# EAGLE design serial_relay (EAGLE 9.0.1)
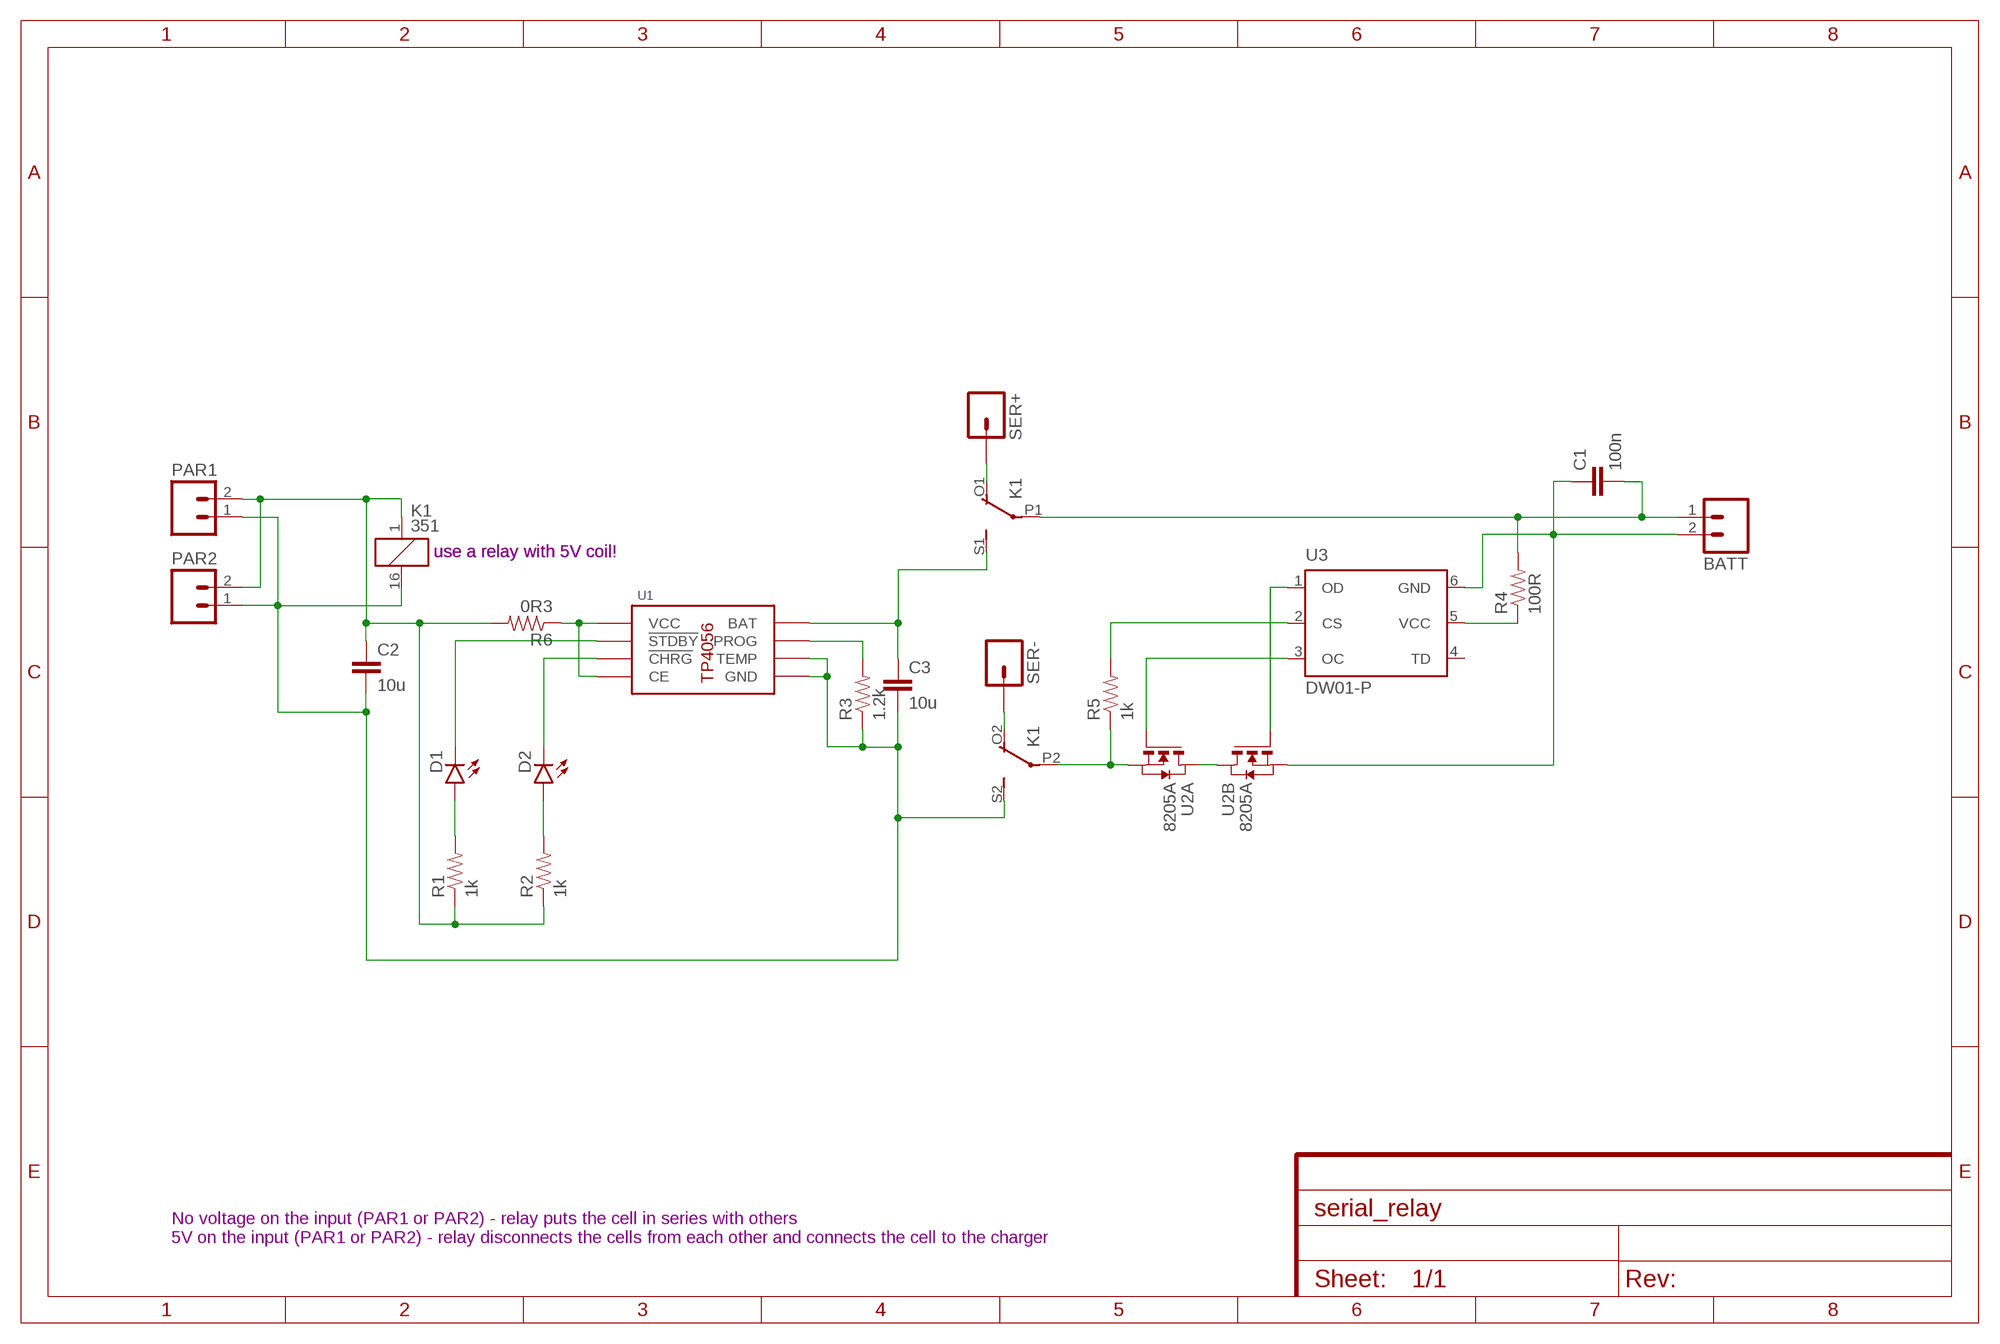
[diagram p0: schematic, sheet 1]

## Parts
BATT  M02PTH3  [1X02_LONGPADS]
C1  100n  CAP1206  [1206]
C2  10u  CAP1206  [1206]
C3  10u  CAP1206  [1206]
D1  LED1206  [LED-1206]
D2  LED1206  [LED-1206]
K1  351  [351]
PAR1  M02PTH3  [1X02_LONGPADS]
PAR2  M02PTH3  [1X02_LONGPADS]
R1  1k  RESISTOR1206  [1206]
R2  1k  RESISTOR1206  [1206]
R3  1.2k  RESISTOR1206  [1206]
R4  100R  RESISTOR1206  [1206]
R5  1k  RESISTOR1206  [1206]
R6  0R3  RESISTOR1206  [1206]
SER+  M01PTH_LONGPAD  [1X01_LONGPAD]
SER-  M01PTH_LONGPAD  [1X01_LONGPAD]
U1  TP4056  [SOP8]
U2  8205A  [TSSOP8]
U3  DW01-P  [SOT23-6L]

## Nets
N$1: K1.P2(3:P) R5.1 U2.2(A:S) U2.3(A:S)
N$2: K1.O1(2:O) SER+.1
N$3: K1.O2(3:O) SER-.1
N$4: D1.A R1.2
N$5: D1.C U1.6(!STDBY)
N$6: R4.1 U3.5(VCC)
N$7: D2.A R2.2
N$8: BATT.2 C1.1 U2.6(B:S) U2.7(B:S) U3.6(GND)
N$9: U2.1(A:D) U2.8(B:D)
N$10: U2.5(B:G) U3.1(OD)
N$11: U2.4(A:G) U3.3(OC)
N$12: D2.C U1.7(!CHRG)
N$13: R5.2 U3.2(CS)
N$14: R3.2 U1.2(PROG)
N$15: R6.1 U1.4(VCC) U1.8(CE)
N$18: C2.1 K1.1 PAR1.2 PAR2.2 R1.1 R2.1 R6.2
N$19: C2.2 C3.2 K1.16 K1.S2(3:S) PAR1.1 PAR2.1 R3.1 U1.1(TEMP) U1.3(GND)
V+: BATT.1 C1.2 K1.P1(2:P) R4.2
V_BATT: C3.1 K1.S1(2:S) U1.5(BAT)
Unconnected: U3.4(TD)

## Notes on the sheet
- use a relay with 5V coil! | use a relay with 5V coil!
- No voltage on the input (PAR1 or PAR2) - relay puts the cell in series with others
  5V on the input (PAR1 or PAR2) - relay disconnects the cells from each other and connects the cell to the charger

## Library data of the parts
BATT PAR1 PAR2 = SparkFun-Connectors:M02: Standard 2-pin 0.1" header. Use with - straight break away headers ( PRT-00116) - right angle break away headers (PRT-00553) - swiss pins (PRT-00743) - machine pins (PRT-00117) - female headers (PRT-00115) Molex polarized connector foot print use with: PRT-08233 with associated crimp pins and housings. 2.54_SCREWTERM for use with PRT-10571. 3.5mm Screw Terminal footprints for PRT-08084 5mm Screw Terminal footprints for use with PRT-08432
C1-C3 = SparkFun-Capacitors:CAP: Capacitor Standard 0603 ceramic capacitor, and 0.1" leaded capacitor.
D1 D2 = SparkFun-LED:LED: LEDs Standard schematic elements and footprints for 5mm, 3mm, 1206, and 0603 sized LEDs. 5mm - Spark Fun Electronics SKU : COM-00529 (and others)
K1 = relay:351: RELAY 2 x switch, Omron; OC_FARNELL: unknown; OC_NEWARK: unknown
R1-R6 = SparkFun-Resistors:RESISTOR: Resistor Basic schematic elements and footprints for 0603, 1206, and PTH resistors.
SER+ SER- = SparkFun-Connectors:M01: Header 1 Standard 1-pin 0.1" header. Use with straight break away headers (SKU : PRT-00116), right angle break away headers (PRT-00553), swiss pins (PRT-00743), machine pins (PRT-00117), and female headers (PRT-00115). SMTSO-256-ET is a "flush mount" nut for a 4-40 screw. The older package used to be too tight, and did not allow it to sit properly thru the drill hit. The latest (0.165DIA) fits nice and snug.
U1 = custom:TP4056
U2 = lipo:8205A: DUAL N-CHANNEL MOSFET The 8205A uses advanced trench technology to provide excellent RDS(ON), low gate charge and operation with gate voltages as low as 2.5V. This device is suitable for use as a Battery protection or in other Switching application.
U3 = lipo:DW01-P: One Cell Lithium-ion/Polymer Battery Protection IC The DW01-P battery protection IC is designed to protect lithium-ion/polymer battery from damage or degrading the lifetime due to overcharge, overdischarge, and/or overcurrent for one-cell lithium-ion/polymer battery powered systems, such as cellular phones. The ultra-small package and less required external components make it ideal to integrate the DW01-P into the limited space of battery pack. The accurate ±50mV overcharging detection voltage ensures safe and full utilization charging. The very low standby current drains little current from the cell while in storage.

## Board
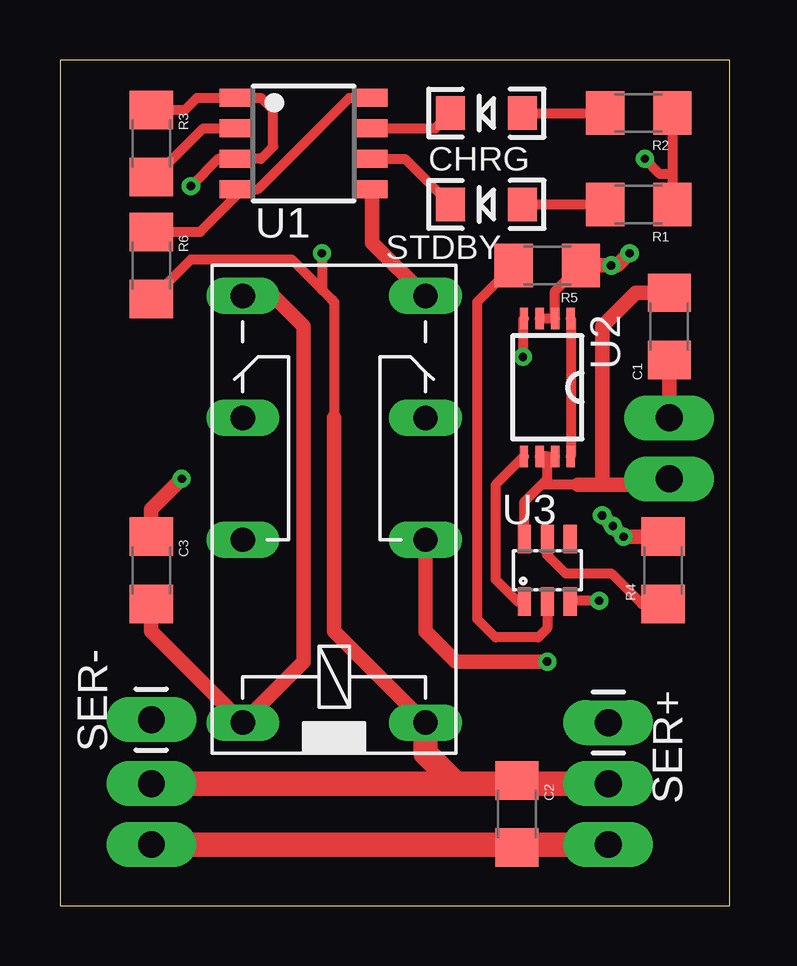
[diagram p1: board, top side]
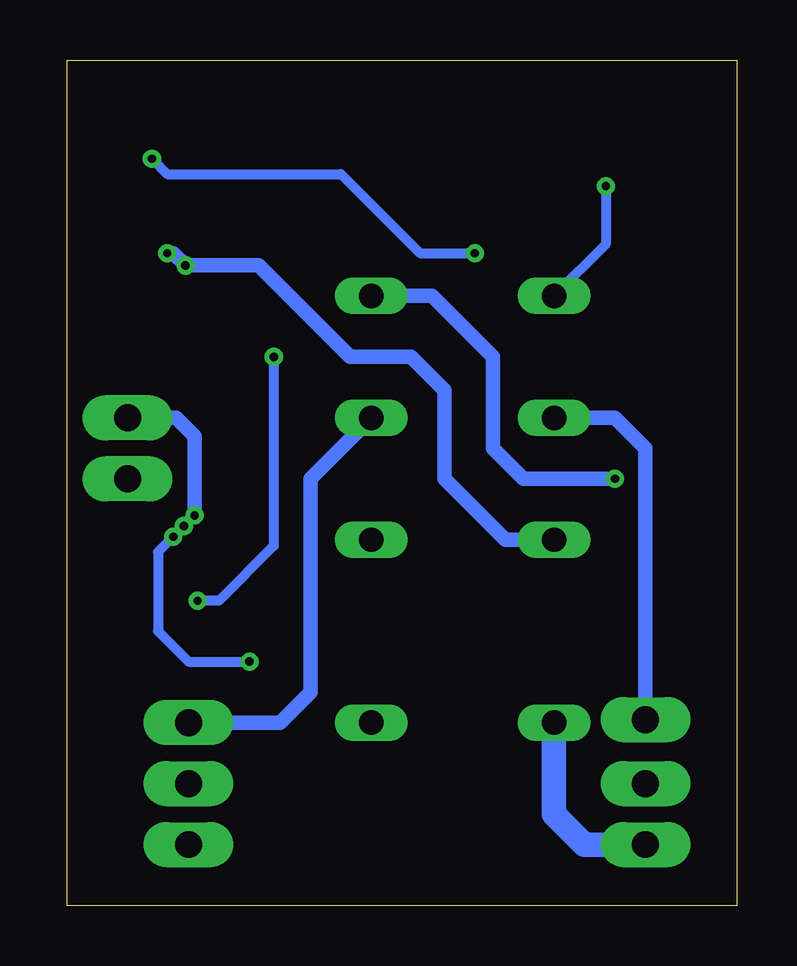
[diagram p2: board, bottom side, seen from below]

Size 27.92 x 35.23 mm. Coordinates in mm from the lower left corner, seen from the top.
Outline: 0,0 27.92,0 27.92,35.23 0,35.23 0,0
Copper layers (1*16): Top 0.035mm / dielectric 1.5mm / Bottom 0.035mm
Design rules "default": minimum track width 6mil, minimum drill 0.35mm, track to track 6mil, track to pad 6mil, pad to pad 6mil, via to via 6mil, smd to smd 6mil, copper to edge 40mil, drill to drill 6mil, minimum pad ring 10mil, minimum via ring 8mil, stop-mask expansion 4mil, vias tented up to drill 0mil, thermal gap 10mil

### Footprints (pad centres in the part's own frame; a part is rotated, then mirrored left to right if it is on the bottom)
1X02_LONGPADS = drill 1.118 pad 1.88 long: 1 0,0; 2 2.54,0
1206 = smd 1.6 x 1.8: 1 -1.4,0; 2 1.4,0
LED-1206 = smd 1.2 x 1.4: A -1.5,0; C 1.5,0
351 = drill 1.016 long: 1 -3.81,-3.81; 16 -3.81,3.81; O1 8.89,-3.81; O2 8.89,3.81; P1 3.81,-3.81; P2 3.81,3.81; S1 13.97,-3.81; S2 13.97,3.81
1X01_LONGPAD = drill 1.118 pad 1.88 long: 1 0,0
SOP8 = smd 0.76 x 1.27: 1 -1.905,-2.86; 2 -0.635,-2.86; 3 0.635,-2.86; 4 1.905,-2.86; 5 1.905,2.86; 6 0.635,2.86; 7 -0.635,2.86; 8 -1.905,2.86
TSSOP8 = smd 0.9 x 0.35: 1 -2.875,0.975; 2 -2.875,0.325; 3 -2.875,-0.325; 4 -2.875,-0.975; 5 2.875,-0.975; 6 2.875,-0.325; 7 2.875,0.325; 8 2.875,0.975
SOT23-6L = smd 0.55 x 1.2: 1 -0.95,-1.3; 2 0,-1.3; 3 0.95,-1.3; 4 0.95,1.3; 5 0,1.3; 6 -0.95,1.3

### Placement (x,y rotation side)
BATT  25.4,20.32 270 top
C1  25.4,24.13 270 top
C2  19.05,3.81 270 top
C3  3.81,13.97 270 top
D1  17.78,29.21 180 top
D2  17.78,33.02 180 top
K1  11.43,11.43 90 top
PAR1  3.81,2.54 90 top
PAR2  22.86,2.54 90 top
R1  24.13,29.21 180 top
R2  24.13,33.02 180 top
R3  3.81,31.75 270 top
R4  25.15,13.97 90 top
R5  20.32,26.67 180 top
R6  3.81,26.67 270 top
SER+  22.86,7.62 270 top
SER-  3.81,7.75 90 top
U1  10.16,31.75 270 top
U2  20.32,21.59 270 top
U3  20.32,13.97 0 top

### Tracks (layer width: path | path; a pad name or v marks a point on that pad's centre or on a via)
N$1  (via drill 0.35)
  Top 0.406: U2.3 U2.2 20.64,25.59 R5.1
  Top 0.61: R5.1 v22.99,26.67 23.24,26.67 v23.75,27.18
  Bottom 0.61: K1.P2 9.65,15.24 12.19,17.78 12.19,21.46 13.59,22.86 16.13,22.86 19.94,26.67 v22.99,26.67 23.5,27.18 v23.75,27.18
N$2
  Bottom 0.61: K1.O1 17.78,17.78 17.78,8.89 19.05,7.62 SER+.1
N$3
  Bottom 0.61: SER-.1 3.81,19.05 5.08,20.32 K1.O2
N$4
  Top 0.406: D1.A R1.2
N$5
  Top 0.406: U1.6 14.38,31.12 D1.C
N$6
  Top 0.406: U3.5 20.32,14.6 21.08,13.84 22.99,13.84 24.26,12.57 R4.1
N$7
  Top 0.406: D2.A R2.2 22.86,33.02
N$8
  Top 0.406: 20.32,18.72 U2.7 | 20.32,18.72 U2.6 | U3.6 19.37,16.83 20.07,17.53 | 20.07,17.53 20.32,17.78 20.32,18.72 | 25.15,17.53 22.61,17.53 21.59,17.53 20.07,17.53
  Top 0.61: C1.1 24.01,25.53 22.61,24.13 22.61,17.53 | BATT.2 25.15,17.53 21.59,17.53
N$9
  Top 0.406: U2.1 U2.8
N$10
  Top 0.406: U2.5 18.16,17.53 18.16,13.59 19.08,12.67 U3.1
N$11  (via drill 0.35)
  Top 0.406: U2.4 19.3,24.42 v19.3,22.86 | v22.48,12.7 21.3,12.7 U3.3
  Bottom 0.406: v19.3,22.86 19.3,14.99 21.59,12.7 v22.48,12.7
N$12
  Top 0.406: U1.7 15.64,32.38 D2.C
N$13
  Top 0.406: R5.2 17.4,25.15 17.4,11.94 18.16,11.18 19.94,11.18 20.32,11.56 U3.2
N$14
  Top 0.406: R3.2 3.93,30.35 5.97,32.38 U1.2
N$15
  Top 0.406: 7.62,29.84 U1.4 | 7.62,29.84 8.25,29.84 12.07,33.66 U1.8 | R6.1 5.85,28.07 7.62,29.84
N$18  (via drill 0.35)
  Top 0.406: R2.1 25.53,30.48 | 25.53,30.48 R1.1 | R6.2 5.46,26.92 9.65,26.92 11.3,25.27 | 11.3,25.27 11.43,25.15 11.43,20.32 | 25.53,30.48 25.02,30.48 v24.38,31.12 | v10.92,27.18 10.92,25.65 11.3,25.27
  Top 0.61: 11.43,20.32 11.43,11.43 K1.1
  Top 1.016: 16.51,5.08 PAR1.2 | 19.05,5.08 16.51,5.08 | 19.05,5.08 PAR2.2 | K1.1 15.24,6.35 16.51,5.08 | C2.1 19.05,5.08
  Bottom 0.406: v24.38,31.12 23.75,30.48 16.51,30.48 13.21,27.18 v10.92,27.18
N$19  (via drill 0.35)
  Top 0.406: v5.46,29.97 6.6,31.12 U1.3 8.38,31.12 8.89,31.62 8.89,33.15 8.38,33.66 U1.1 5.71,33.66 5.21,33.15 R3.1
  Top 0.61: K1.S2 8.89,25.4 10.16,24.13 10.16,10.16 K1.16 3.81,11.43 C3.2
  Top 1.016: 19.05,2.54 PAR1.1 | 19.05,2.54 PAR2.1 | C2.2 19.05,2.54
  Bottom 0.406: v5.46,29.97 5.46,27.56 K1.S2
  Bottom 1.016: K1.16 7.62,3.81 6.35,2.54 PAR1.1
V+  (via drill 0.35)
  Top 0.61: C1.2 BATT.1 | R4.2 v23.5,15.37 v23.05,15.81 v22.61,16.26 | K1.P1 15.24,11.43 16.51,10.16 v20.32,10.16
  Bottom 0.406: v22.61,16.26 24.13,14.73 24.13,11.43 22.86,10.16 v20.32,10.16
  Bottom 0.61: BATT.1 23.37,20.32 22.61,19.56 v22.61,16.26
V_BATT  (via drill 0.35)
  Top 0.61: U1.5 13.02,27.62 K1.S1 | v5.08,17.78 3.81,16.51 C3.1
  Bottom 0.61: K1.S1 12.7,25.4 10.16,22.86 10.16,19.05 8.89,17.78 v5.08,17.78

### Text on the board
tNames: CHRG | STDBY